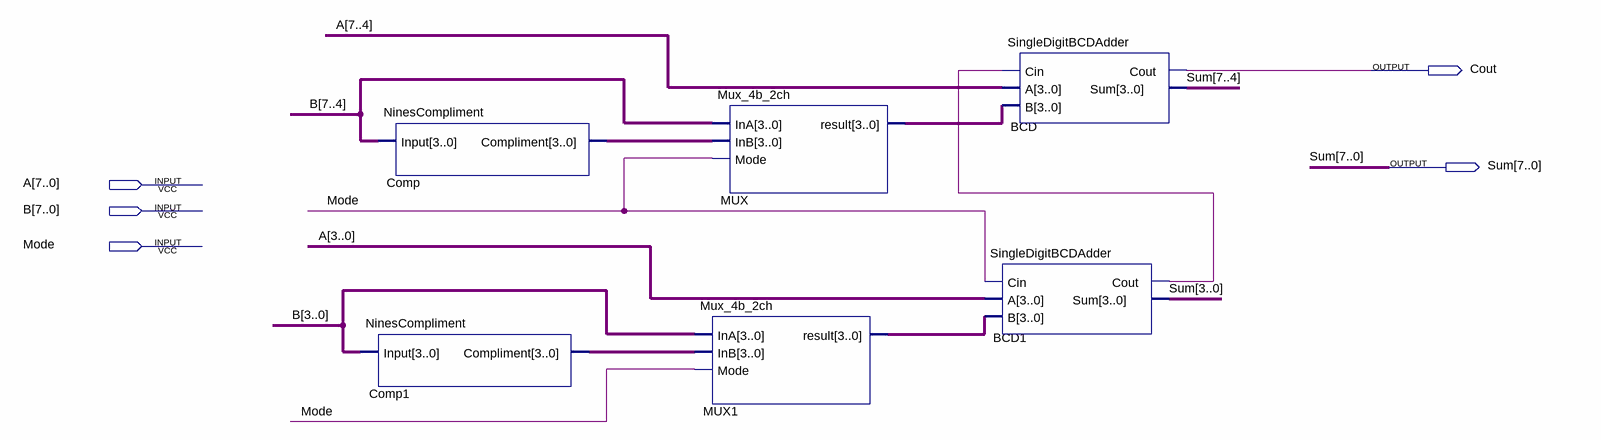
[diagram p0: schematic sheet]
// Quartus schematic TwoDigitBCDAdderSubtractor.bdf as structural Verilog: 6 symbols, 5 pins
module TwoDigitBCDAdderSubtractor (
  input  [7:0] A,
  input  [7:0] B,
  input  Mode,
  output Cout,
  output [7:0] Sum
);

  wire BCD1_cout;
  wire [3:0] Comp1_compliment, Comp_compliment, MUX1_result, MUX_result;

  NinesCompliment Comp1 (.Input(B[3:0]), .Compliment(Comp1_compliment));
  NinesCompliment Comp (.Input(B[7:4]), .Compliment(Comp_compliment));
  Mux_4b_2ch MUX (.InA(B[7:4]), .InB(Comp_compliment), .Mode(Mode), .result(MUX_result));
  Mux_4b_2ch MUX1 (.InA(B[3:0]), .InB(Comp1_compliment), .Mode(Mode), .result(MUX1_result));
  SingleDigitBCDAdder BCD1 (.Cin(Mode), .A(A[3:0]), .B(MUX1_result), .Cout(BCD1_cout), .Sum(Sum[3:0]));
  SingleDigitBCDAdder BCD (.Cin(BCD1_cout), .A(A[7:4]), .B(MUX_result), .Cout(Cout), .Sum(Sum[7:4]));
endmodule
